# Altium schematic sheet İşlemci.SchDoc
size A4; SheetNumber: 5; SheetTotal: 5
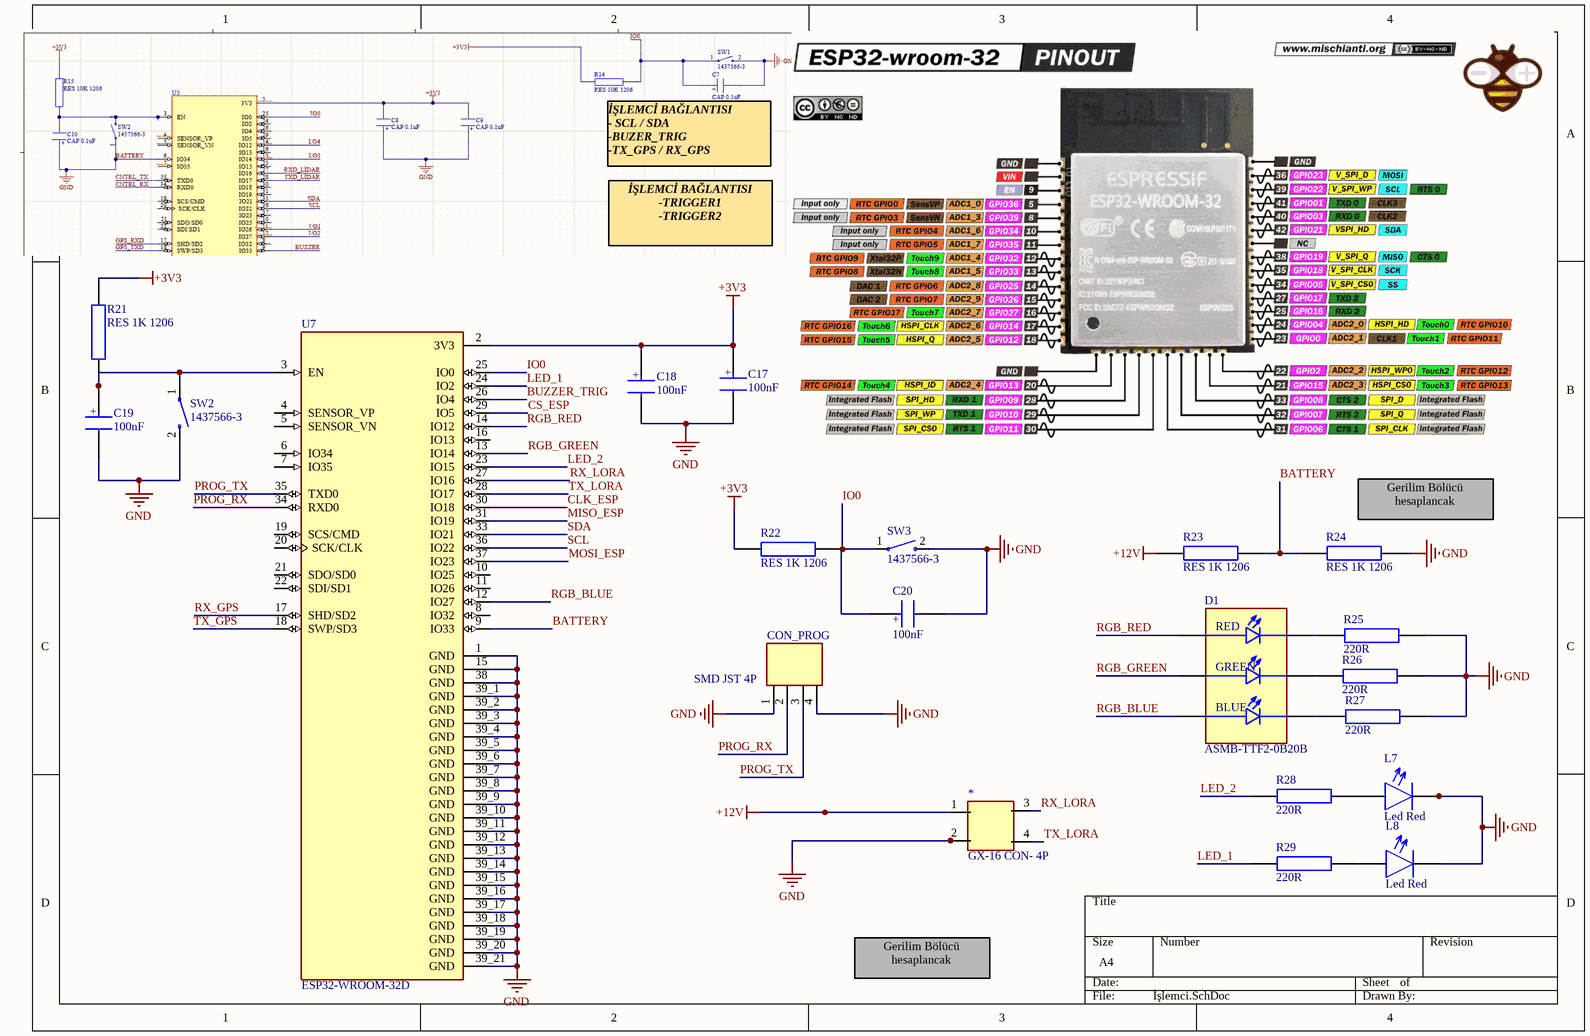
[diagram p0: İşlemci.SchDoc]

## Parts
*  GX-16 CON- 4P  [GX-16 CON]
C17  100nF  [CAP_805]
C18  100nF  [CAP_805]
C19  100nF  [CAP_805]
C20  100nF  [CAP_805]
CON_PROG  SMD JST 4P  [L-KLS1-XL1-4P]
D1  ASMB-TTF2-0B20B  [LED_ASMB-TTF2-0B20B]
L7  Led Red  [Led 1206]
L8  Led Red  [Led 1206]
R21  RES 1K 1206  [RES_1206]
R22  RES 1K 1206  [RES_1206]
R23  RES 1K 1206  [RES_1206]
R24  RES 1K 1206  [RES_1206]
R25  220R  [RES_1206]
R26  220R  [RES_1206]
R27  220R  [RES_1206]
R28  220R  [RES_1206]
R29  220R  [RES_1206]
SW2  1437566-3  [SW_1437566-3]
SW3  1437566-3  [SW_1437566-3]
U7  ESP32-WROOM-32D  [MODULE_ESP32-WROOM-32D]

## Nets
+3V3: C17.1 C18.1 R21.2 R22.2 U7.2(3V3)
+12V: *.1 R23.1
GND: *.2 C17.2 C18.2 C19.2 C20.2 CON_PROG.1 CON_PROG.4 L7.2 L8.2 R24.2 R25.1 R26.1 R27.1 SW2.2 SW3.2 U7.1(GND) U7.15(GND) U7.38(GND) U7.39_1(GND) U7.39_2(GND) U7.39_3(GND) U7.39_4(GND) U7.39_5(GND) U7.39_6(GND) U7.39_7(GND) U7.39_8(GND) U7.39_9(GND) U7.39_10(GND) U7.39_11(GND) U7.39_12(GND) U7.39_13(GND) U7.39_14(GND) U7.39_15(GND) U7.39_16(GND) U7.39_17(GND) U7.39_18(GND) U7.39_19(GND) U7.39_20(GND) U7.39_21(GND)
BATTERY: R23.2 R24.1 U7.9(IO33)
BUZZER_TRIG: U7.26(IO4)
CLK_ESP: U7.30(IO18)
CS_ESP: U7.29(IO5)
IO0: C20.1 R22.1 SW3.1 U7.25(IO0)
LED_1: R29.2 U7.24(IO2)
LED_2: R28.2 U7.23(IO15)
MISO_ESP: U7.31(IO19)
MOSI_ESP: U7.37(IO23)
PROG_RX: CON_PROG.2 U7.34(RXD0)
PROG_TX: CON_PROG.3 U7.35(TXD0)
RGB_BLUE: D1.5(B_A) U7.12(IO27)
RGB_GREEN: D1.3(G_A) U7.13(IO14)
RGB_RED: D1.1(R_A) U7.14(IO12)
RX_GPS: U7.17(SHD/SD2)
RX_LORA: *.3 U7.27(IO16)
SCL: U7.36(IO22)
SDA: U7.33(IO21)
TX_GPS: U7.18(SWP/SD3)
TX_LORA: *.4 U7.28(IO17)
NetC19_1: C19.1 R21.1 SW2.1 U7.3(EN)
NetD1_2: D1.2(R_C) R25.2
NetD1_4: D1.4(G_C) R26.2
NetD1_6: D1.6(B_C) R27.2
NetL7_1: L7.1 R28.1
NetL8_1: L8.1 R29.1

Not connected (* = marked no-connect by the designer): U7 4(SENSOR_VP) 5(SENSOR_VN) 6(IO34) 7(IO35) 8(IO32) 10(IO25) 11(IO26) 16(IO13) 19(SCS/CMD) 20(SCK/CLK) 21(SDO/SD0) 22(SDI/SD1)

## Notes on the sheet
- İŞLEMCİ BAĞLANTISI
  - SCL / SDA
  -BUZER_TRIG
  -TX_GPS / RX_GPS
- İŞLEMCİ BAĞLANTISI
  -TRIGGER1
  -TRIGGER2
- (near R24) Gerilim Bölücü hesaplancak
- Gerilim Bölücü hesaplancak
- (in symbol ASMB-TTF2-0B20B) RED; GREEN; BLUE
- (in symbol CAP 1uF) +

## Library data of the parts
C17-C20 = CAP 1uF: 0805 smd
D1 = ASMB-TTF2-0B20B: LED RGB DIFFUSED 6PLCC SMD; MF: Broadcom / Avago; Purchase-URL: https://pricing.snapeda.com/search/part/ASMB-TTF2-0B20B/?ref=eda; Value: *; Availability: In Stock; Package: None; Check_prices: https://www.snapeda.com/parts/ASMB-TTF2-0B20B/Avago/view-part/?ref=eda; SnapEDA_Link: https://www.snapeda.com/parts/ASMB-TTF2-0B20B/Avago/view-part/?ref=snap; MP: ASMB-TTF2-0B20B; Price: None
R25-R29 = RES 1K 1206
SW2 SW3 = 1437566-3: Switch Tactile OFF (ON) SPST Rectangular Button Gull Wing 0.05A 12VDC SMD Loose Piece; Price: None; Value: *; Package: None; Availability: Unavailable; MP: 1437566-3
U7 = ESP32-WROOM-32D: Bluetooth, WiFi 802.11b/g/n, Bluetooth v4.2 +EDR, Class 1, 2 and 3 Transceiver Module 2.4GHz ~ 2.5GHz Integrated; MF: Espressif Systems; Price: None; Availability: In Stock; Package: Module Espressif Systems; MP: ESP32-WROOM-32D; Value: *; SnapEDA_Link: https://www.snapeda.com/parts/ESP32-WROOM-32D/Espressif+Systems/view-part/?ref=snap; Purchase-URL: https://pricing.snapeda.com/search/part/ESP32-WROOM-32D/?ref=eda; Check_prices: https://www.snapeda.com/parts/ESP32-WROOM-32D/Espressif+Systems/view-part/?ref=eda